# Altium schematic sheet SEG_pressure gauge_don  V2.4.SchDoc
size A2
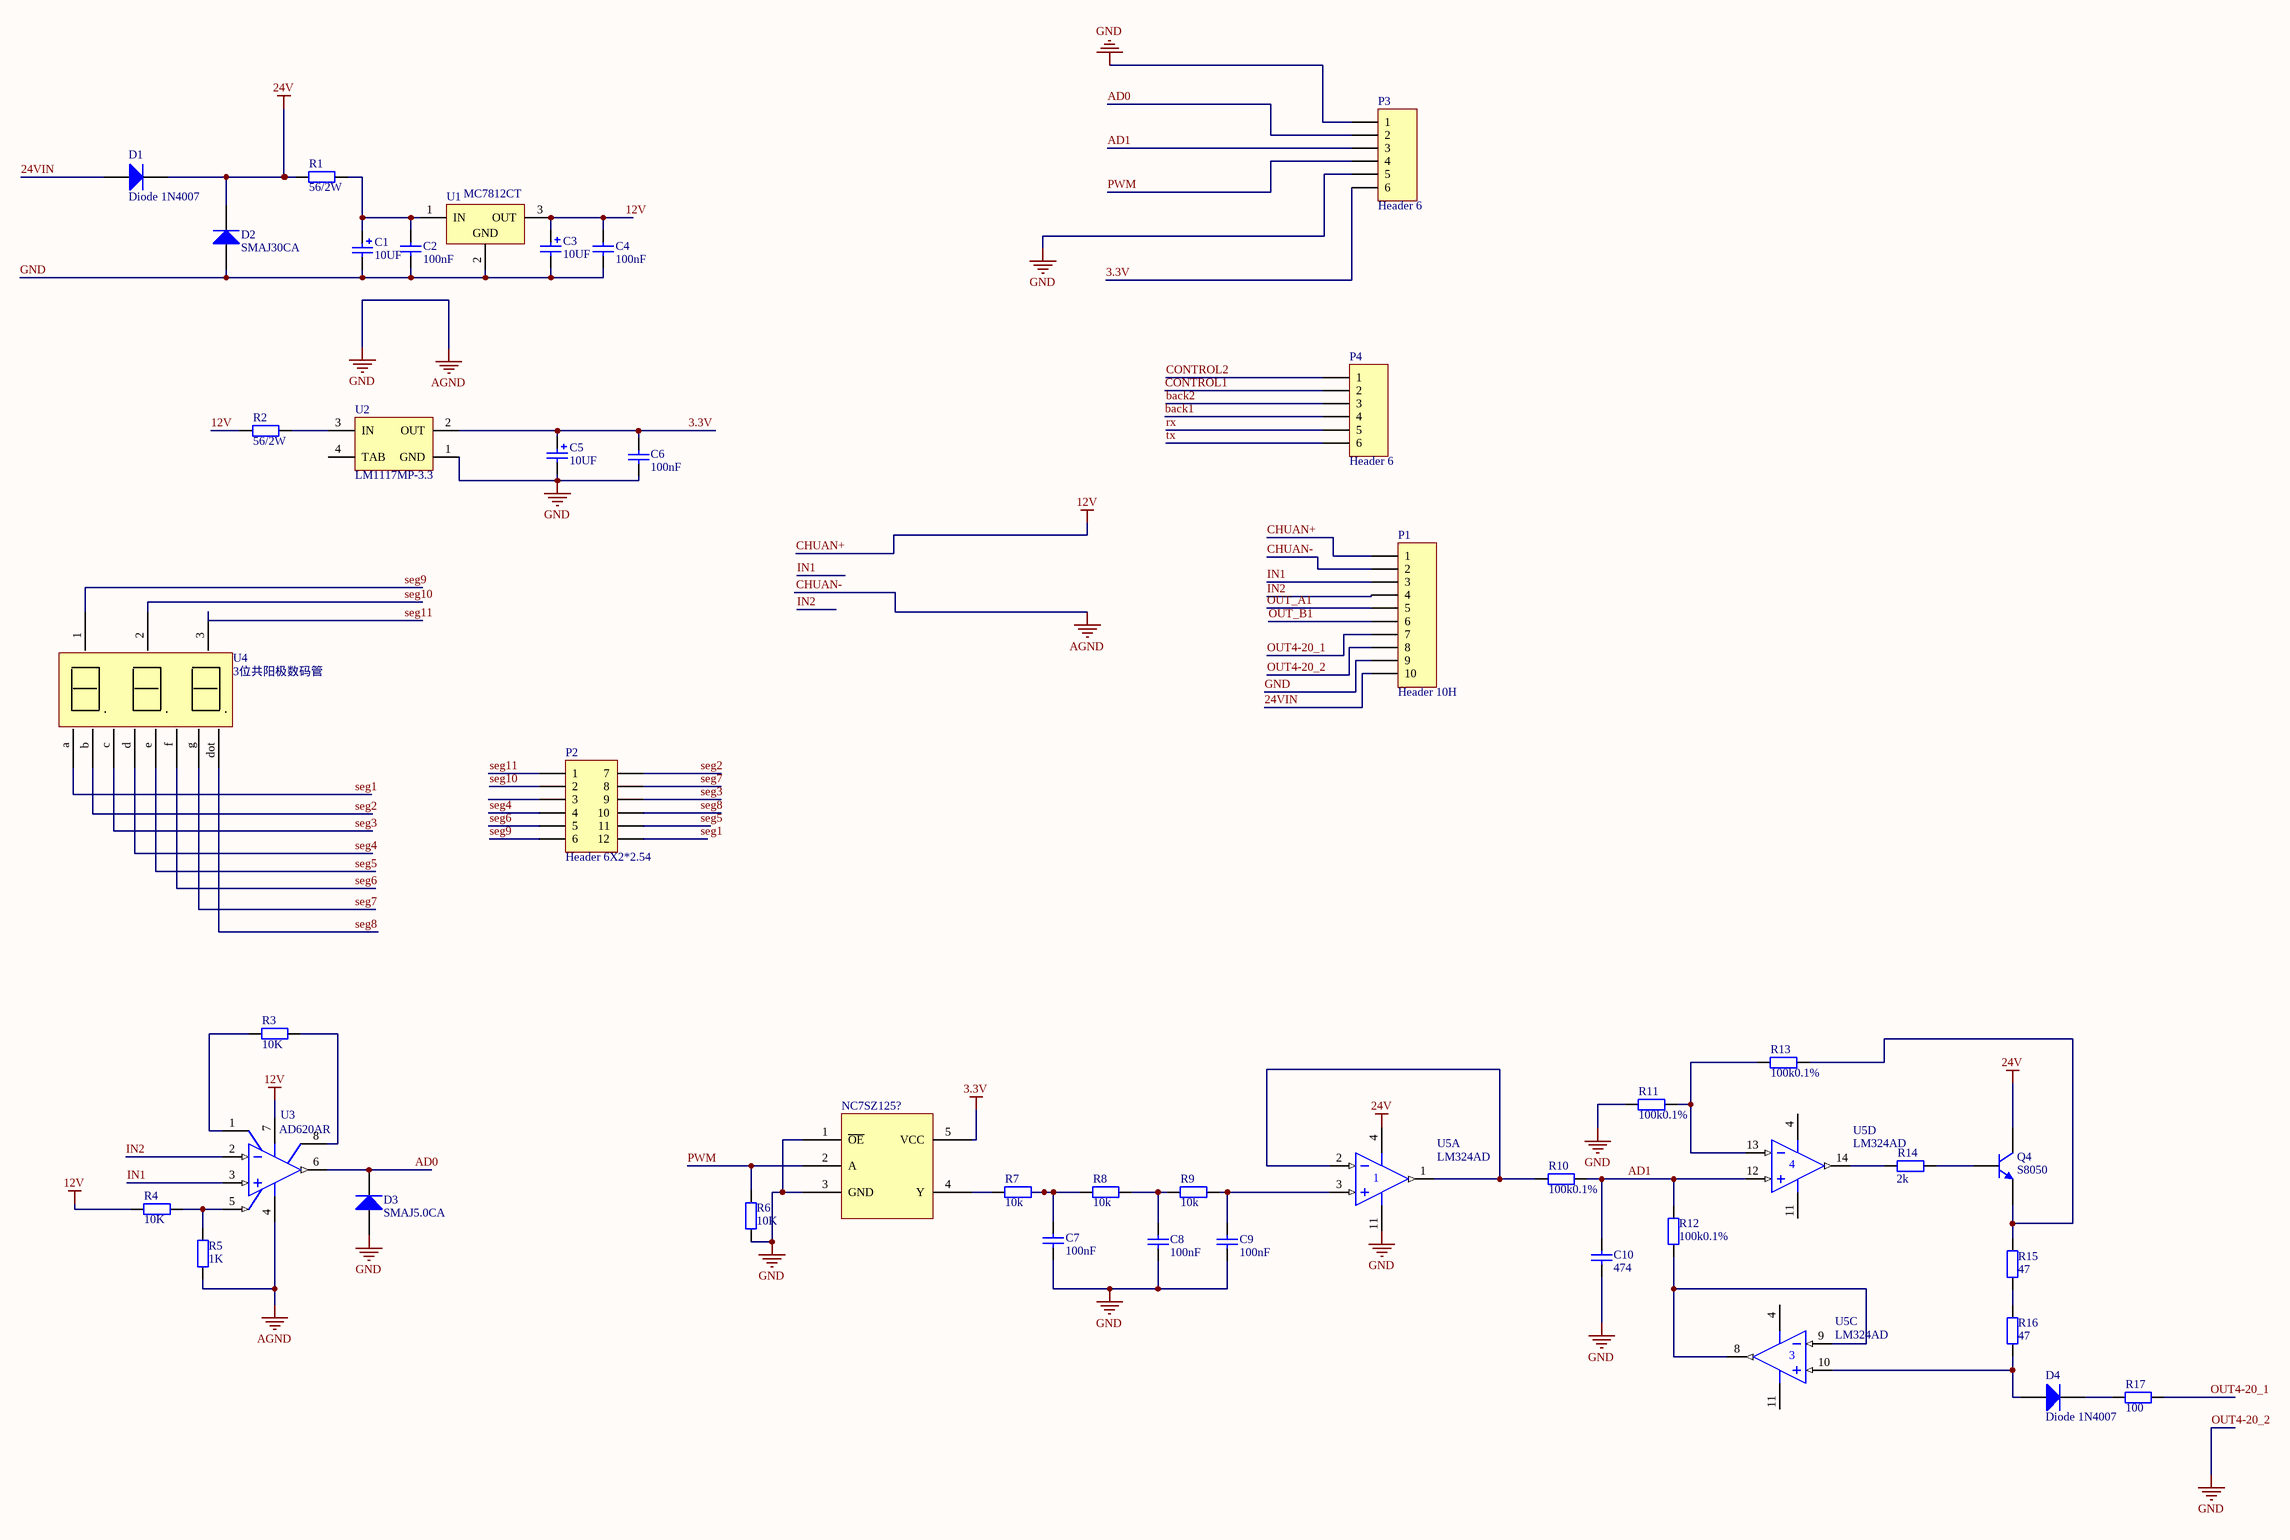
[diagram p0: SEG_pressure gauge_don  V2.4.SchDoc]

## Parts
C1  10uf  [3216]
C2  100nf  [0805_C_Y]
C3  10uf  [3216]
C4  100nf  [0805_C_Y]
C5  10uf  [3216]
C6  100nf  [0805_C_Y]
C7  100nf  [0805_C_Y]
C8  100nf  [0805_C_Y]
C9  100nf  [0805_C_Y]
C10  474  [0805_C_Y]
D1  Diode 1N4007  [DO-214]
D2  SMAJ30CA  [DO-214]
D3  SMAJ5.0CA  [DO-214]
D4  Diode 1N4007  [DO-214]
NC7SZ125?  NC7SZ125  [SOT23-5]  (value not drawn)
P1  Header 10H  [HDR1X10H]
P2  Header 6X2*2.54  [HDR2X6_CEN]
P3  Header 6  [HDR1X6]
P4  Header 6  [HDR1X6]
Q4  S8050  [SOT-23_Y]
R1  56/2W  [PCBComponent_1 - duplicate]
R2  56/2W  [PCBComponent_1 - duplicate]
R3  10k  [0805_R_Y]
R4  10k  [0805_R_Y]
R5  1k  [0805_R_Y]
R6  10k  [0805_R_Y]
R7  10k  [0805_R_Y]
R8  10k  [0805_R_Y]
R9  10k  [0805_R_Y]
R10  value 100k0.1%  [0805_R_Y]  (hidden comment: 100k)
R11  value 100k0.1%  [0805_R_Y]  (hidden comment: 100k)
R12  value 100k0.1%  [0805_R_Y]  (hidden comment: 100k)
R13  value 100k0.1%  [0805_R_Y]  (hidden comment: 100k)
R14  2k  [0805_R_Y]
R15  47  [0805_R_Y]
R16  47  [0805_R_Y]
R17  100  [0805_R_Y]
U1  MC7812CT  [TO-220]
U2  LM1117MP-3.3  [MP04A_M]
U3  AD620AR  [SO-8_Y]
U4  3位共阳极数码管  [3位数码管0.56]
U5  LM324AD  [D014_N]  (parts A,C,D of 4)

## Nets
3.3V: C5.1 C6.1 NC7SZ125?.5(VCC) P3.6 U2.2(OUT)
12V: C3.1 C4.1 P1.1 R2.1 R4.2 U1.3(OUT) U3.7(V+)  [also labelled CHUAN+]
24V: D1.2(K) D2.2(K) Q4.3(C) R1.1 U5.4(V+)
CHUAN-: C1.2 C2.2 C3.2 C4.2 C5.2 C6.2 C7.2 C8.2 C9.2 C10.2 D2.1(A) D3.1(A) NC7SZ125?.1(~{OE}) NC7SZ125?.3(GND) P1.2 P1.8 P1.9 P3.1 P3.5 R5.1 R6.2 R11.2 U1.2(GND) U2.1(GND) U3.4(V-) U5.11(V-)  [also labelled AGND, GND, OUT4-20_2]
24VIN: D1.1(A) P1.10
AD0: D3.2(K) P3.2 U3.6(OUT)
AD1: C10.1 P3.3 R10.1 R12.2 U5.12(IN+)
back1: P4.4
back2: P4.3
CONTROL1: P4.2
CONTROL2: P4.1
IN1: P1.3 U3.3(+IN)
IN2: P1.4 U3.2(-IN)
OUT4-20_1: P1.7 R17.2
OUT_A1: P1.5
OUT_B1: P1.6
PWM: NC7SZ125?.2(A) P3.4 R6.1
rx: P4.5
seg1: P2.12 U4.a
seg2: P2.7 U4.b
seg3: P2.9 U4.c
seg4: P2.4 U4.d
seg5: P2.11 U4.e
seg6: P2.5 U4.f
seg7: P2.8 U4.g
seg8: P2.10 U4.dot
seg9: P2.6 U4.1
seg10: P2.2 U4.2
seg11: P2.1 U4.3
tx: P4.6
NetC1_1: C1.1 C2.1 R1.2 U1.1(IN)
NetC7_1: C7.1 R7.1 R8.2
NetC8_1: C8.1 R8.1 R9.2
NetC9_1: C9.1 R9.1 U5.3(IN+)
NetD4_1: D4.1(A) R16.2 U5.10(IN+)
NetD4_2: D4.2(K) R17.1
NetNC7SZ125?_4: NC7SZ125?.4(Y) R7.2
NetQ4_1: Q4.1(B) R14.1
NetQ4_2: Q4.2(E) R13.1 R15.1
NetR2_2: R2.2 U2.3(IN)
NetR3_1: R3.1 U3.1(RG)
NetR3_2: R3.2 U3.8(RG)
NetR4_1: R4.1 R5.2 U3.5(REF)
NetR10_2: R10.2 U5.1(OUT) U5.2(IN-)
NetR11_1: R11.1 R13.2 U5.13(IN-)
NetR12_1: R12.1 U5.8(OUT) U5.9(IN-)
NetR14_2: R14.2 U5.14(OUT)
NetR15_2: R15.2 R16.1

Not connected (* = marked no-connect by the designer): P2 3; U2 4(TAB)

## Library data of the parts
C1 C3 C5 = Cap Pol2: Polarized Capacitor (Axial); Published: 8-Jun-2000; LatestRevisionDate: 17-Jul-2002; LatestRevisionNote: Re-released for DXP Platform.; PackageReference: POLAR0.8; Publisher: Altium Limited; Value: 10UF
C2 C4 C6-C10 = Cap: Capacitor; Published: 8-Jun-2000; LatestRevisionDate: 17-Jul-2002; LatestRevisionNote: Re-released for DXP Platform.; PackageReference: RAD-0.3; Publisher: Altium Limited
  C2 C4 C6-C9: Value: 100nF
  C10: Value: 474
D1 = Diode 1N4007: 1 Amp General Purpose Rectifier; Published: 8-Jun-2000; LatestRevisionDate: 17-Jul-2002; LatestRevisionNote: Re-released for DXP Platform.; DatasheetVersion: 1998; PackageVersion: Aug-1999; PackageReference: DO-41; Publisher: Altium Limited; Code_JEDEC: DO-204-AL; ComponentLink1Description: Manufacturer Link; ComponentLink1URL: http://www.fairchildsemi.com/; ComponentLink2Description: Datasheet; ComponentLink2URL: http://www.fairchildsemi.com/ds/1N%2F1N4001.pdf
D2-D4 = Diode 1N5402: 3 Amp General Purpose Rectifier; Published: 8-Jun-2000; LatestRevisionDate: 17-Jul-2002; LatestRevisionNote: Re-released for DXP Platform.; DatasheetVersion: 1998; PackageVersion: Aug-1999; PackageReference: DO-201AD; Publisher: Altium Limited; ComponentLink1Description: Manufacturer Link; ComponentLink1URL: http://www.fairchildsemi.com/; ComponentLink2Description: Datasheet; ComponentLink2URL: http://www.fairchildsemi.com/ds/1N%2F1N5400.pdf
P1 = Header 10H: Header, 10-Pin, Right Angle; LatestRevisionDate: 17-Jul-2002; LatestRevisionNote: Re-released for DXP Platform.; Publisher: Altium Limited
P2 = Header 6X2A: Header, 6-Pin, Dual row; LatestRevisionDate: 17-Jul-2002; LatestRevisionNote: Re-released for DXP Platform.; Publisher: Altium Limited
P3 P4 = Header 6: Header, 6-Pin; LatestRevisionDate: 17-Jul-2002; LatestRevisionNote: Re-released for DXP Platform.; Publisher: Altium Limited
Q4 = 2N3904: NPN General Purpose Amplifier; Published: 8-Jun-2000; LatestRevisionDate: 15-Jan-2003; LatestRevisionNote: PCB Footprint 'BCY-W3/D4.7' replaced; DatasheetVersion: 1997; PackageVersion: Sep-1998; PackageReference: TO-92A; Publisher: Altium Limited; Code_JEDEC: TO-92A; ComponentLink1Description: Manufacturer Link; ComponentLink1URL: http://www.fairchildsemi.com/; ComponentLink2Description: Datasheet; ComponentLink2URL: http://www.fairchildsemi.com/ds/2N%2F2N3904.pdf
R1-R17 = Res2: Resistor; Published: 8-Jun-2000; LatestRevisionDate: 17-Jul-2002; LatestRevisionNote: Re-released for DXP Platform.; PackageReference: AXIAL-0.4; Publisher: Altium Limited
  R1 R2: Value: 56/2W
  R3 R4 R6: Value: 10K
  R5: Value: 1K
  R7-R9: Value: 10k
  R14: Value: 2k
  R15 R16: Value: 47
  R17: Value: 100
U1 = MC7812CT: Three-Terminal Positive Voltage Regulator; Note: Heatsink surface is connected to Pin 2; Published: 15-Apr-2002; DatasheetVersion: 1997; PackageVersion: 1997; PackageReference: 221A-06; Publisher: Altium Limited; PackageDescription: TO, Thru-Hole, Vertical, Heatsink Mounted; 3 In-Line Leads; Pitch 2.54 mm; Code_JEDEC: TO-262-AA; ComponentLink1Description: Manufacturer Link; ComponentLink1URL: http://www.onsemi.com/site/products/taxonomy/0,4438,503,00.html; ComponentLink2Description: Datasheet; ComponentLink2URL: http://www.onsemi.com/pub/Collateral/MC7800-D.PDF
U2 = LM1117MP-3.3: 800mA Low-Dropout Linear Regulator; Manufacturer: National Semiconductor; CompType: LDO IC; PackageTopMarking: XYTT*N05A; PowerWise: N; Published: 4-Dec-2008; DatasheetVersion: Apr-2006; PackageVersion: revB, Apr-2003; PackageReference: MP04A; Publisher: Altium Limited; PackageDescription: Molded SOT-223, 6.50 x 3.56 x 1.6mm Body, 4 Lead, 2.3mm Pitch; PartNumber: LM1117MP-3.3; RoHS: O; PinCount: 4; DigiKeyPartNumber: LM1117MP-3.3CT-ND; Code_JEDEC: TO-261-AA; Code_IPC: SOT223-4; ComponentLink1Description: LM1117 Datasheet; ComponentLink1URL: http://www.national.com/ds/LM/LM1117.pdf; ComponentLink2Description: LM1117 Web Page; ComponentLink2URL: http://www.national.com/pf/LM/LM1117.html; ComponentLink3Description: MP04A Package Page; ComponentLink3URL: http://www.national.com/packaging/folders/mp04a.html
U3 = AD620AR: Low-Cost, Low-Power Instrumentation Amplifier; Published: 8-Jun-2000; LatestRevisionDate: 13-Apr-2006; LatestRevisionNote: IPC-7351 Footprint Added.; DatasheetVersion: REV.D 1998; PackageVersion: 1998; PackageReference: R-8D; Publisher: Altium Limited; PackageDescription: 8-Pin Narrow Body Small Outline Integrated Circuit 1.27 mm Pitch; ComponentLink1Description: Manufacturer Link; ComponentLink1URL: http://www.analog.com/en/prod/0%2C2877%2CAD620%2C00.html; ComponentLink2Description: Datasheet; ComponentLink2URL: http://www.analog.com/UploadedFiles/Data_Sheets/897653854AD620_g.pdf
U5 = LM324AD: Quadruple Operational Amplifier; Published: 15-Apr-2002; LatestRevisionDate: 13-Apr-2006; LatestRevisionNote: IPC-7351 Footprint Added.; DatasheetVersion: Jan-1989; PackageVersion: Jan-1998; PackageReference: D014; Publisher: Altium Limited; PackageDescription: 14-Pin Small Outline Integrated Circuit 1.27 mm Pitch; Code_IPC: SOIC127P600-14; ComponentLink1Description: Manufacturer Link; ComponentLink1URL: http://www.ti.com/; ComponentLink2Description: Datasheet; ComponentLink2URL: http://www-s.ti.com/sc/ds/lm324.pdf